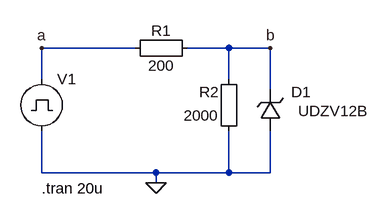
[diagram p0: schematic Z-CL-POS.asc]
Z-CL-POS.asc, the LTspice schematic file:
Version 4
SHEET 1 880 680
WIRE 16 112 -128 112
WIRE 160 112 96 112
WIRE 224 112 160 112
WIRE -128 160 -128 112
WIRE 160 160 160 112
WIRE 224 176 224 112
WIRE -128 304 -128 240
WIRE 48 304 -128 304
WIRE 160 304 160 240
WIRE 160 304 48 304
WIRE 224 304 224 240
WIRE 224 304 160 304
WIRE 48 320 48 304
FLAG -128 112 a
FLAG 224 112 b
FLAG 48 320 0
SYMBOL Misc\\EuropeanResistor 112 96 R90
WINDOW 0 5 56 VBottom 2
WINDOW 3 27 56 VTop 2
SYMATTR InstName R1
SYMATTR Value 200
SYMBOL zener 240 240 R180
WINDOW 0 -47 60 Left 2
WINDOW 3 -135 31 Left 2
SYMATTR InstName D1
SYMATTR Value UDZV12B
SYMATTR Description Diode
SYMATTR Type diode
SYMBOL pulse -128 144 R0
WINDOW 3 24 44 Invisible 2
WINDOW 123 0 0 Left 2
WINDOW 39 0 0 Left 2
SYMATTR Value PULSE(-20V 20V 1u 0.1u 0.1u 2u 5u)
SYMATTR InstName V1
SYMBOL Misc\\EuropeanResistor 176 256 R180
WINDOW 0 31 76 Left 2
WINDOW 3 31 40 Left 2
SYMATTR InstName R2
SYMATTR Value 2000
TEXT -128 328 Left 2 !.tran 20u

The netlist it stands for:
* Z-CL-POS.asc
R1 b a 200
D1 0 b UDZV12B
V1 a 0 PULSE(-20V 20V 1u 0.1u 0.1u 2u 5u)
R2 0 b 2000
.model D D
.lib standard.dio
.tran 20u
.backanno
.end